# EAGLE schematic LIS3MDL (EAGLE 7.1.0)
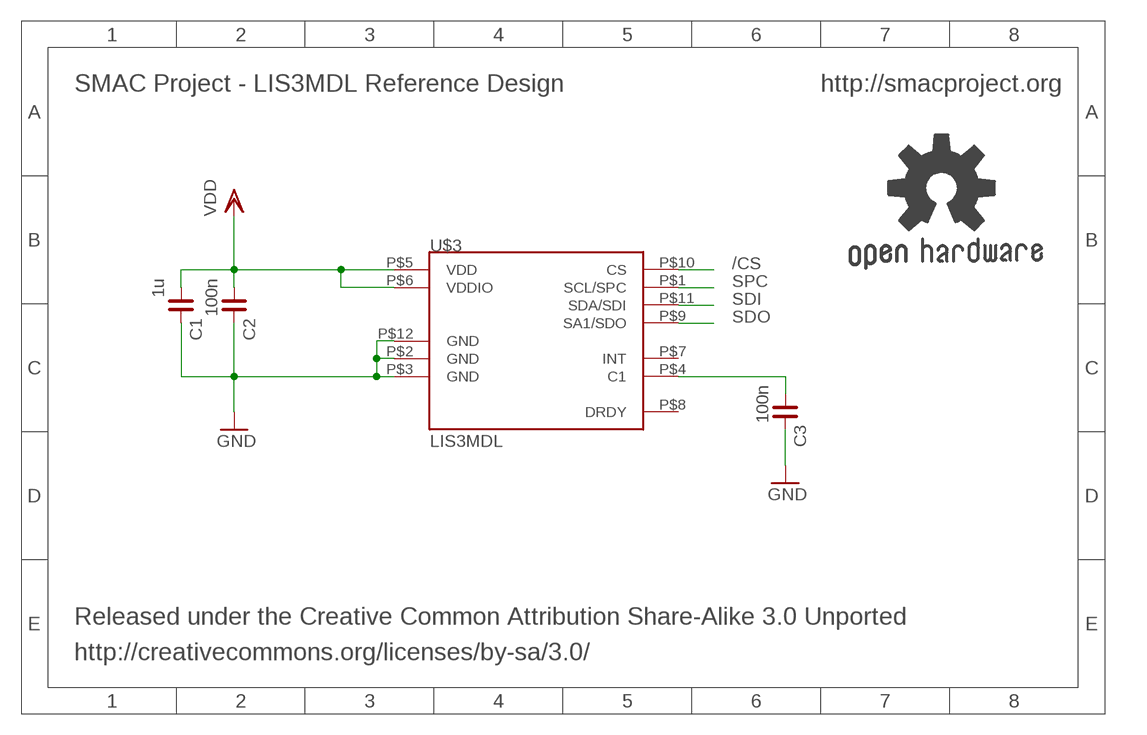
[diagram p0: schematic, sheet 1]

## Parts
C1  1u  C_0402  [C0402]
C2  100n  C_0402  [C0402]
C3  100n  C_0402  [C0402]
GOLD_ORB_SM1  OSHWLOGO_REF_SM  [OSHW2REF]
U$3  LIS3MDL  [VFLGA-2X2X1]

## Nets
/CS: U$3.P$10(CS)
GND: C1.2 C2.2 C3.2 U$3.P$2(GND) U$3.P$3(GND) U$3.P$12(GND)
N$3: C3.1 U$3.P$4(C1)
SDI: U$3.P$11(SDA/SDI)
SDO: U$3.P$9(SA1/SDO)
SPC: U$3.P$1(SCL/SPC)
VDD: C1.1 C2.1 U$3.P$5(VDD) U$3.P$6(VDDIO)
Unconnected: U$3.P$7(INT) U$3.P$8(DRDY)

## Notes on the sheet
- SMAC Project - LIS3MDL Reference Design | http://smacproject.org
- Released under the Creative Common Attribution Share-Alike 3.0 Unported
- http://creativecommons.org/licenses/by-sa/3.0/

## Library data of the parts
C1-C3 = rc-master-smd:C_: NON-POLARIZED CAP
GOLD_ORB_SM1 = bfl:OSHWLOGO: These are Open-Source Hardware logos.
U$3 = SparkFun-Sensors:LIS3MDL